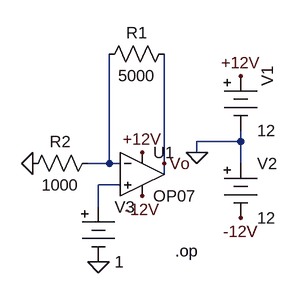
[diagram p0: schematic OPAMP.asc]
OPAMP.asc, the LTspice schematic file:
Version 4
SHEET 1 880 680
WIRE 384 80 384 64
WIRE 384 80 320 80
WIRE 320 96 320 80
WIRE 192 112 192 -48
WIRE 192 112 160 112
WIRE 208 112 192 112
WIRE 272 112 272 -48
WIRE 384 112 384 80
WIRE 272 128 272 112
WIRE 208 144 176 144
WIRE 176 176 176 144
FLAG 320 96 0
FLAG 176 256 0
FLAG 80 112 0
FLAG 384 -16 +12V
FLAG 384 192 -12V
FLAG 240 160 -12V
FLAG 240 96 +12V
FLAG 272 112 Vo
SYMBOL OpAmps\\OP07 240 64 R0
SYMATTR InstName U1
SYMBOL res 176 96 R90
WINDOW 0 0 56 VBottom 2
WINDOW 3 32 56 VTop 2
SYMATTR InstName R2
SYMATTR Value 1000
SYMBOL Misc\\battery 384 -32 R0
WINDOW 0 39 31 VLeft 2
WINDOW 123 0 0 Left 0
WINDOW 39 24 132 Left 2
SYMATTR InstName V1
SYMATTR Value 12
SYMBOL Misc\\battery 384 96 R0
SYMATTR InstName V2
SYMATTR Value 12
SYMBOL Misc\\battery 176 160 R0
SYMATTR InstName V3
SYMATTR Value 1
SYMBOL res 288 -64 R90
WINDOW 0 0 56 VBottom 2
WINDOW 3 32 56 VTop 2
SYMATTR InstName R1
SYMATTR Value 5000
TEXT 288 240 Left 2 !.op

The netlist it stands for:
* OPAMP.asc
XU1 N002 N001 +12V -12V Vo LT1001  ; OP07, pins In+ In- V+ V- OUT
R2 N001 0 1000
V1 +12V 0 12
V2 0 -12V 12
V3 N002 0 1
R1 Vo N001 5000
.op
.lib LTC.lib
.backanno
.end